# Altium project PCB_Project_TP3_mleroi.PrjPcb
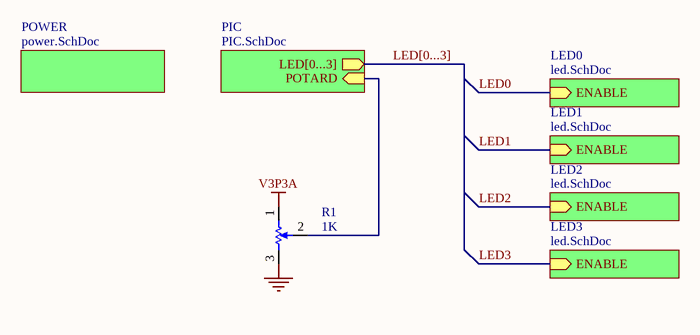
[diagram p0: TP2.SchDoc]
4 sheets, 36 parts. Net scope: hierarchical (ports join the sheet entries above them; power ports are global).
Board file: TP3_PCB.PcbDoc
Sheets:
  TP2.SchDoc
    POWER = power.SchDoc
    PIC = PIC.SchDoc
    LED0 = led.SchDoc
    LED1 = led.SchDoc
    LED2 = led.SchDoc
    LED3 = led.SchDoc

## Sheet TP2.SchDoc
size A; PageSetup: Record=PageOptions|CenterHorizontal=True|CenterVertical=True|PrintScale=1.00|XCorrection=1.00|YCorrection=1.00|PrintKind=0|BorderSize=5000000|LeftOffset=0|BottomOffset=0|Orientation=2|PaperLength=1000|PaperWidth=1000|Scale=100|PaperSource=7|PrintQuality=-3|MediaType=1|DitherType=10|PrintScaleMode=1|PaperKind=Letter|PaperIndex=1

### Parts
R1  1K  [PDB181-K415K-102A2]

### Sub-sheets
LED0 = led.SchDoc: ENABLE
LED1 = led.SchDoc: ENABLE
LED2 = led.SchDoc: ENABLE
LED3 = led.SchDoc: ENABLE
PIC = PIC.SchDoc: LED[0...3], POTARD
POWER = power.SchDoc: no entries

### Nets
V3P3A: R1.1(+)
VCC: R1.3(-)
NetR1_2: R1.2(W) ; sheet PIC/POTARD

### Buses and harness runs
bus LED[0...3] = sheet PIC/LED[0...3]

### Library data of the parts
R1 = RPot SM: Potentiometer; Fabricant: BOURNS; RefFournisseur: 1823540; Fournisseur: Farnell; Published: 17-Dec-2003; DatasheetVersion: Oct-2003; PackageReference: POT4MM-2; Publisher: Altium Limited; PackageDescription: Square Trimming Potentiometer; ComponentLink1Description: Manufacturer Link; ComponentLink1URL: http://bourns.com/2/search.html; RefFabricant: PDB181-K415K-102A2

## Sheet power.SchDoc
size A
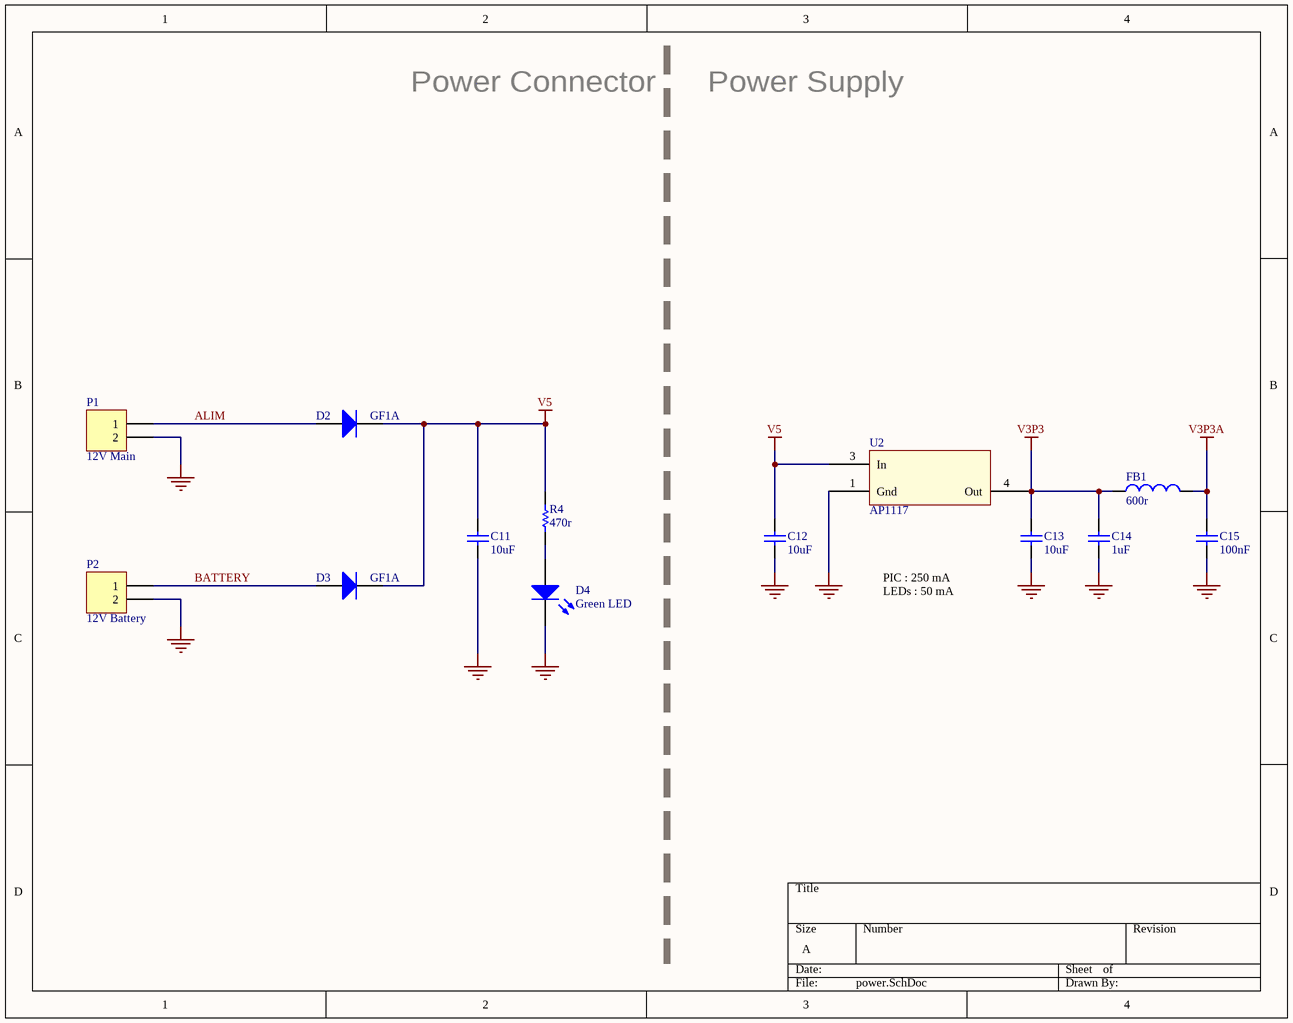
[diagram p1: power.SchDoc]

### Parts
C11  10uF  [CAPC2012N]
C12  10uF  [CAPC2012N]
C13  10uF  [CAPC2012N]
C14  1uF  [CAPC1608N]
C15  100nF  [CAPC1608N]
D2  GF1A  [SMA/DO-214AC_21]
D3  GF1A  [SMA/DO-214AC_21]
D4  Green LED  [LED 0805]
FB1  600r  [INDC1608AN]
P1  12V Main  [PHOENIX_1985195]
P2  12V Battery  [PHOENIX_1985195]
R4  470r  [RESC1608N]
U2  AP1117  [TD03B_N]

### Nets
GND: C11.1 C12.2 C13.2 C14.1 C15.1 D4.2(K) P1.2 P2.2 U2.1(Gnd)
V3P3: C13.1 C14.2 FB1.1 U2.4(Out)
V3P3A: C15.2 FB1.2
V5: C11.2 C12.1 D2.2(K) D3.2(K) R4.2 U2.3(In)
ALIM: D2.1(A) P1.1
BATTERY: D3.1(A) P2.1
NetD4_1: D4.1(A) R4.1

### Notes on the sheet
- Power Connector
- Power Supply
- PIC : 250 mA
- LEDs : 50 mA

### Library data of the parts
C11-C13 = Cap: Capacitor; Value: 100pF; Fabricant: TDK; Fournisseur: Farnell; RefFabricant: C2012X5R0J106M/1.25; RefFournisseur: 2309029; Published: 8-Jun-2000; LatestRevisionDate: 17-Jul-2002; LatestRevisionNote: Re-released for DXP Platform.; PackageReference: RAD-0.3; Publisher: Altium Limited; PackageDescription: Radial Cap, Thru-Hole; 2 Leads; 0.3 in Pin Spacing
C14 C15 = Cap: Capacitor; Value: 100pF; Published: 8-Jun-2000; LatestRevisionDate: 17-Jul-2002; LatestRevisionNote: Re-released for DXP Platform.; PackageReference: RAD-0.3; Publisher: Altium Limited; PackageDescription: Radial Cap, Thru-Hole; 2 Leads; 0.3 in Pin Spacing
D2 D3 = Diode: Default Diode; Fabricant: VISHAY; Fournisseur: Farnell; RefFabricant: GF1A-E3/67A; RefFournisseur: 9549560; Published: 8-Jun-2000; LatestRevisionDate: 17-Jul-2002; LatestRevisionNote: Re-released for DXP Platform.; PackageVersion: Sep-1996; PackageReference: SMC; Publisher: Altium Limited; PackageDescription: DO-214-AB/SMC; 2 C-Bend Leads; Body 7.9 x 5.9 mm, inc. leads (LxW); Code_JEDEC: DO-214-AB
D4 = LED0: Typical INFRARED GaAs LED; Fabricant: KINGBRIGHT; Fournisseur: Farnell; RefFabricant: KPT-2012SGC; RefFournisseur: 2099239; Published: 8-Jun-2000; LatestRevisionDate: 08-Jul-2005; LatestRevisionNote: Mech Layer 1 removed.; PackageReference: LED-0; Publisher: Altium Limited; PackageDescription: LED; 2 Leads
FB1 = Inductor: Code_IEC: 1005; Value: 10mH; Fabricant: Wurth; Fournisseur: Farnell; RefFabricant: 742792651; RefFournisseur: 1635706; Published: 8-Jun-2000; LatestRevisionDate: 29-May-2009; LatestRevisionNote: IPC-7351 Footprint Added.; PackageReference: 0402-A; Publisher: Altium Limited; PackageDescription: Chip Inductor; Code_JEITA: 0402
P1 P2 = Header 2: Header, 2-Pin; Fabricant: PHOENIX CONTACT; Fournisseur: Farnell; RefFabricant: PTSA 1.5/2-3,5-Z; RefFournisseur: 1792769; LatestRevisionDate: 17-Jul-2002; LatestRevisionNote: Re-released for DXP Platform.; Publisher: Altium Limited
R4 = Res1: Resistor; Value: 1K; Published: 8-Jun-2000; LatestRevisionDate: 17-Jul-2002; LatestRevisionNote: Re-released for DXP Platform.; PackageReference: AXIAL-0.3; Publisher: Altium Limited; PackageDescription: Axial Device, Thru-Hole; 2 Leads; 0.3 in Pin Spacing
U2 = AP1117: 1A LDO, 18V input, DPAK; Fabricant: DIODES INC; RefFournisseur: 1825285; Fournisseur: Farnell; RefFabricant: AP1117D33G-13

## Sheet PIC.SchDoc
size A
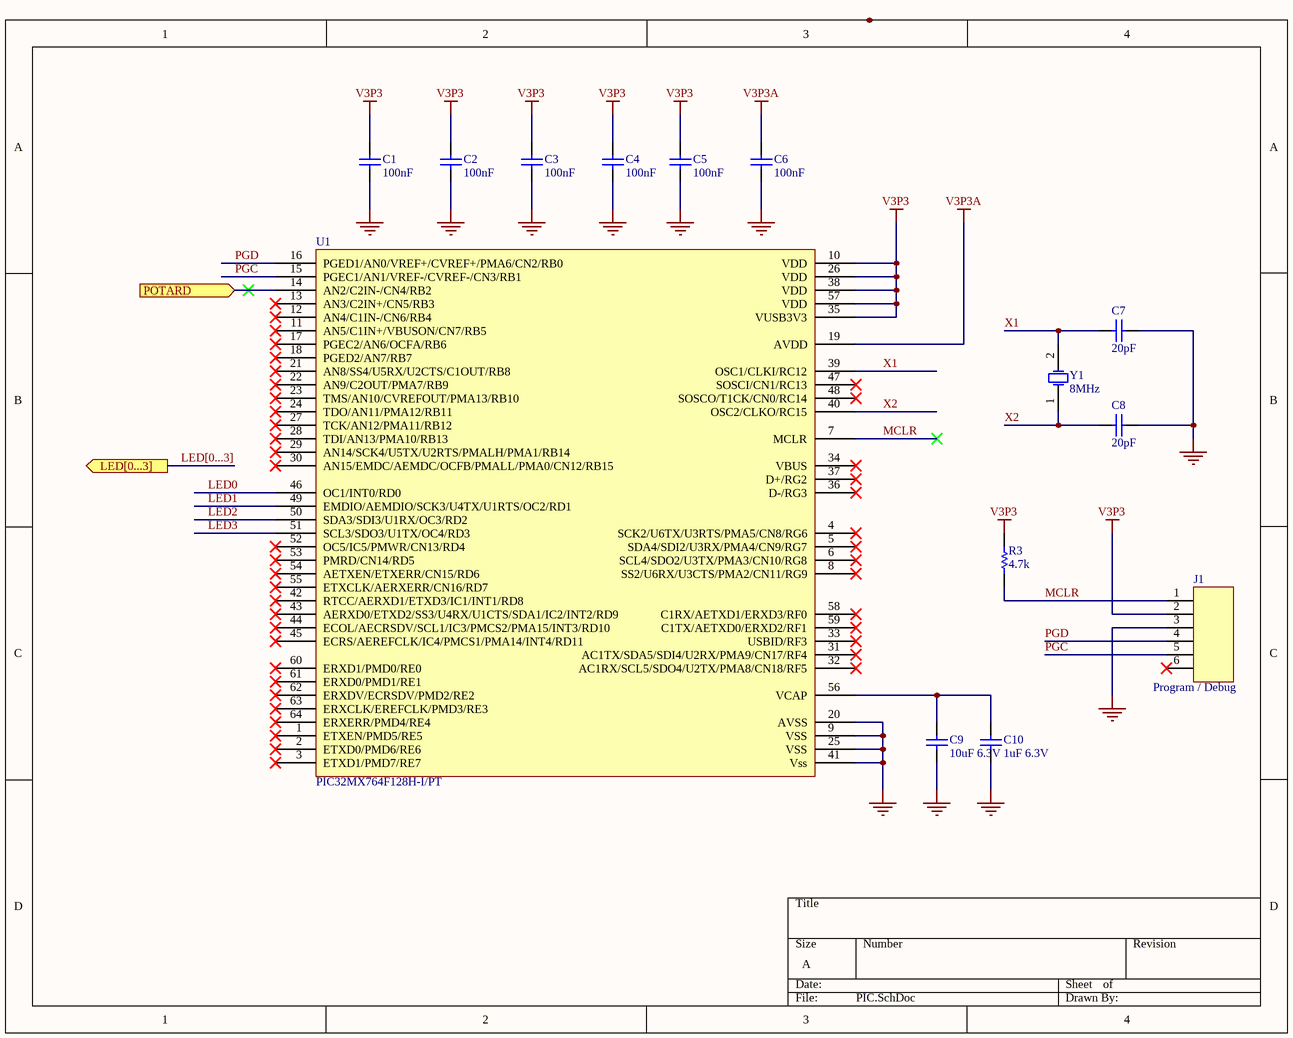
[diagram p2: PIC.SchDoc]

### Parts
C1  100nF  [CAPC1608N]
C2  100nF  [CAPC1608N]
C3  100nF  [CAPC1608N]
C4  100nF  [CAPC1608N]
C5  100nF  [CAPC1608N]
C6  100nF  [CAPC1608N]
C7  20pF  [CAPC1608N]
C8  20pF  [CAPC1608N]
C9  10uF 6.3V  [CAPC2012N]
C10  1uF 6.3V  [CAPC1608N]
J1  Program / Debug  [RJ12_90]
R3  4.7k  [RESC1608N]
U1  PIC32MX764F128H-I/PT  [QFP50P1200X1200X120-64]
Y1  8MHz  [HC49/4H SMX CRYSTAL]

### Ports
LED[0...3] (out), POTARD

### Nets
GND: C1.1 C2.1 C3.1 C4.1 C5.1 C6.1 C7.1 C8.1 C9.1 C10.1 J1.3 U1.9(VSS) U1.20(AVSS) U1.25(VSS) U1.41(Vss)
V3P3: C1.2 C2.2 C3.2 C4.2 C5.2 J1.2 R3.2 U1.10(VDD) U1.26(VDD) U1.35(VUSB3V3) U1.38(VDD) U1.57(VDD)
V3P3A: C6.2 U1.19(AVDD)
LED0: U1.46(OC1/INT0/RD0)
LED1: U1.49(EMDIO/AEMDIO/SCK3/U4TX/U1RTS/OC2/RD1)
LED2: U1.50(SDA3/SDI3/U1RX/OC3/RD2)
LED3: U1.51(SCL3/SDO3/U1TX/OC4/RD3)
MCLR: J1.1 R3.1 U1.7(MCLR)
PGC: J1.5 U1.15(PGEC1/AN1/VREF-/CVREF-/CN3/RB1)
PGD: J1.4 U1.16(PGED1/AN0/VREF+/CVREF+/PMA6/CN2/RB0)
X1: C7.2 U1.39(OSC1/CLKI/RC12) Y1.2(OSC2)
X2: C8.2 U1.40(OSC2/CLKO/RC15) Y1.1(OSC1)
NetC9_2: C9.2 C10.2 U1.56(VCAP)
NetR1_2: U1.14(AN2/C2IN-/CN4/RB2) ; port POTARD

Not connected (* = marked no-connect by the designer): J1 6*; U1 1(ETXEN/PMD5/RE5)* 2(ETXD0/PMD6/RE6)* 3(ETXD1/PMD7/RE7)* 4(SCK2/U6TX/U3RTS/PMA5/CN8/RG6)* 5(SDA4/SDI2/U3RX/PMA4/CN9/RG7)* 6(SCL4/SDO2/U3TX/PMA3/CN10/RG8)* 8(SS2/U6RX/U3CTS/PMA2/CN11/RG9)* 11(AN5/C1IN+/VBUSON/CN7/RB5)* 12(AN4/C1IN-/CN6/RB4)* 13(AN3/C2IN+/CN5/RB3)* 17(PGEC2/AN6/OCFA/RB6)* 18(PGED2/AN7/RB7)* 21(AN8/SS4/U5RX/U2CTS/C1OUT/RB8)* 22(AN9/C2OUT/PMA7/RB9)* 23(TMS/AN10/CVREFOUT/PMA13/RB10)* 24(TDO/AN11/PMA12/RB11)* 27(TCK/AN12/PMA11/RB12)* 28(TDI/AN13/PMA10/RB13)* 29(AN14/SCK4/U5TX/U2RTS/PMALH/PMA1/RB14)* 30(AN15/EMDC/AEMDC/OCFB/PMALL/PMA0/CN12/RB15)* 31(AC1TX/SDA5/SDI4/U2RX/PMA9/CN17/RF4)* 32(AC1RX/SCL5/SDO4/U2TX/PMA8/CN18/RF5)* 33(USBID/RF3)* 34(VBUS)* 36(D-/RG3)* 37(D+/RG2)* 42(RTCC/AERXD1/ETXD3/IC1/INT1/RD8)* 43(AERXD0/ETXD2/SS3/U4RX/U1CTS/SDA1/IC2/INT2/RD9)* 44(ECOL/AECRSDV/SCL1/IC3/PMCS2/PMA15/INT3/RD10)* 45(ECRS/AEREFCLK/IC4/PMCS1/PMA14/INT4/RD11)* 47(SOSCI/CN1/RC13)* 48(SOSCO/T1CK/CN0/RC14)* 52(OC5/IC5/PMWR/CN13/RD4)* 53(PMRD/CN14/RD5)* 54(AETXEN/ETXERR/CN15/RD6)* 55(ETXCLK/AERXERR/CN16/RD7)* 58(C1RX/AETXD1/ERXD3/RF0)* 59(C1TX/AETXD0/ERXD2/RF1)* 60(ERXD1/PMD0/RE0)* 61(ERXD0/PMD1/RE1)* 62(ERXDV/ECRSDV/PMD2/RE2)* 63(ERXCLK/EREFCLK/PMD3/RE3)* 64(ERXERR/PMD4/RE4)*

### Buses and harness runs
bus LED[0...3] = port LED[0...3]

### Library data of the parts
C1-C8 C10 = Cap: Capacitor; Value: 100pF; Published: 8-Jun-2000; LatestRevisionDate: 17-Jul-2002; LatestRevisionNote: Re-released for DXP Platform.; PackageReference: RAD-0.3; Publisher: Altium Limited; PackageDescription: Radial Cap, Thru-Hole; 2 Leads; 0.3 in Pin Spacing
C9 = Cap: as C11 on sheet power; Published: 8-Jun-2000; LatestRevisionDate: 17-Jul-2002; LatestRevisionNote: Re-released for DXP Platform.; PackageReference: RAD-0.3; Publisher: Altium Limited; PackageDescription: Radial Cap, Thru-Hole; 2 Leads; 0.3 in Pin Spacing
J1 = Header 6: Header, 6-Pin; Fabricant: Molex; Fournisseur: Farnell; RefFabricant: 53398-0671; RefFournisseur: 1125368; LatestRevisionDate: 17-Jul-2002; LatestRevisionNote: Re-released for DXP Platform.; Publisher: Altium Limited
R3 = Res1: Resistor; Value: 1K; Published: 8-Jun-2000; LatestRevisionDate: 17-Jul-2002; LatestRevisionNote: Re-released for DXP Platform.; PackageReference: AXIAL-0.3; Publisher: Altium Limited; PackageDescription: Axial Device, Thru-Hole; 2 Leads; 0.3 in Pin Spacing
U1 = PIC32MX764F128H-I/PT: PIC32MX764F128H; Fabricant: Microchip; Fournisseur: Farnell; RefFournisseur: 1971889; RefFabricant: PIC32MX764F128H-I/PT
Y1 = XTAL: Crystal Oscillator; Fabricant: FOX ELECTRONICS; RefFournisseur: 2063972; Fournisseur: Farnell; RefFabricant: FOXSDLF/080-20; Published: 8-Jun-2000; LatestRevisionDate: 17-Jul-2002; LatestRevisionNote: Re-released for DXP Platform.; PackageReference: R38; Publisher: Altium Limited; PackageDescription: Crystal, Thru-Hole; 2 Leads; Body 3.1 x 8.2 mm (Dia.xH)

## Sheet led.SchDoc
size A
Used 4 times, as channels LED0, LED1, LED2, LED3. Parts and nets are listed once, with the designators drawn on the sheet.
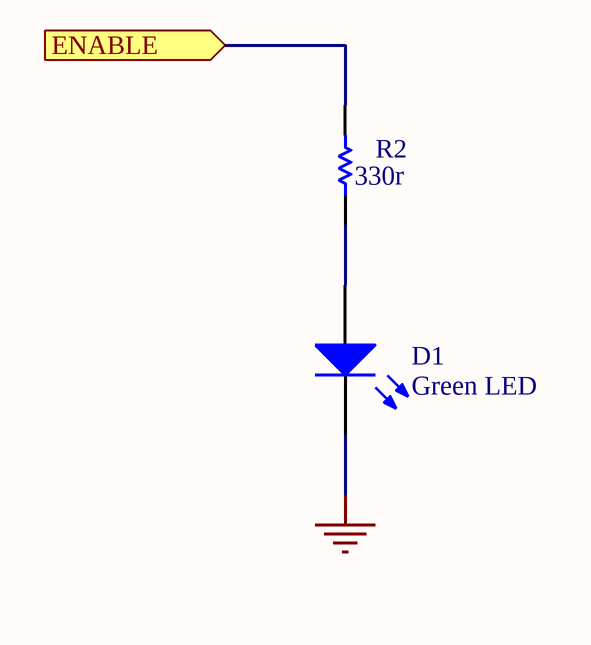
[diagram p3: led.SchDoc]

### Parts
D1  Green LED  [LED 0805]
R2  330r  [RESC1608N]

### Ports
ENABLE

### Nets
Gnd: D1.2(K)
ENABLE: R2.2 ; port ENABLE
NetD1_1: D1.1(A) R2.1

### Channels
LED0: designators end in _LED0; ports ENABLE=LED0
LED1: designators end in _LED1; ports ENABLE=LED1
LED2: designators D1=D1_LED2 R2=1; ports ENABLE=LED2
LED3: designators end in _LED3; ports ENABLE=LED3

### Library data of the parts
D1 = LED0: as D4 on sheet power; Published: 8-Jun-2000; LatestRevisionDate: 08-Jul-2005; LatestRevisionNote: Mech Layer 1 removed.; PackageReference: LED-0; Publisher: Altium Limited; PackageDescription: LED; 2 Leads
R2 = Res1: Resistor; Value: 1K; Published: 8-Jun-2000; LatestRevisionDate: 17-Jul-2002; LatestRevisionNote: Re-released for DXP Platform.; PackageReference: AXIAL-0.3; Publisher: Altium Limited; PackageDescription: Axial Device, Thru-Hole; 2 Leads; 0.3 in Pin Spacing

## Nets that join several sheets
GND: power (9 pins), PIC (15 pins), LED0 (D1_LED0.2), LED1 (D1_LED1.2), LED2 (D1_LED2.2), LED3 (D1_LED3.2)
V3P3: power (C13.1 C14.2 FB1.1 U2.4), PIC (12 pins)
V3P3A: TP2 (R1.1), power (C15.2 FB1.2), PIC (C6.2 U1.19)
NetR1_2: TP2 (R1.2), PIC (U1.14)